# Altium schematic sheet X-Track-ESP32.SchDoc
size A3
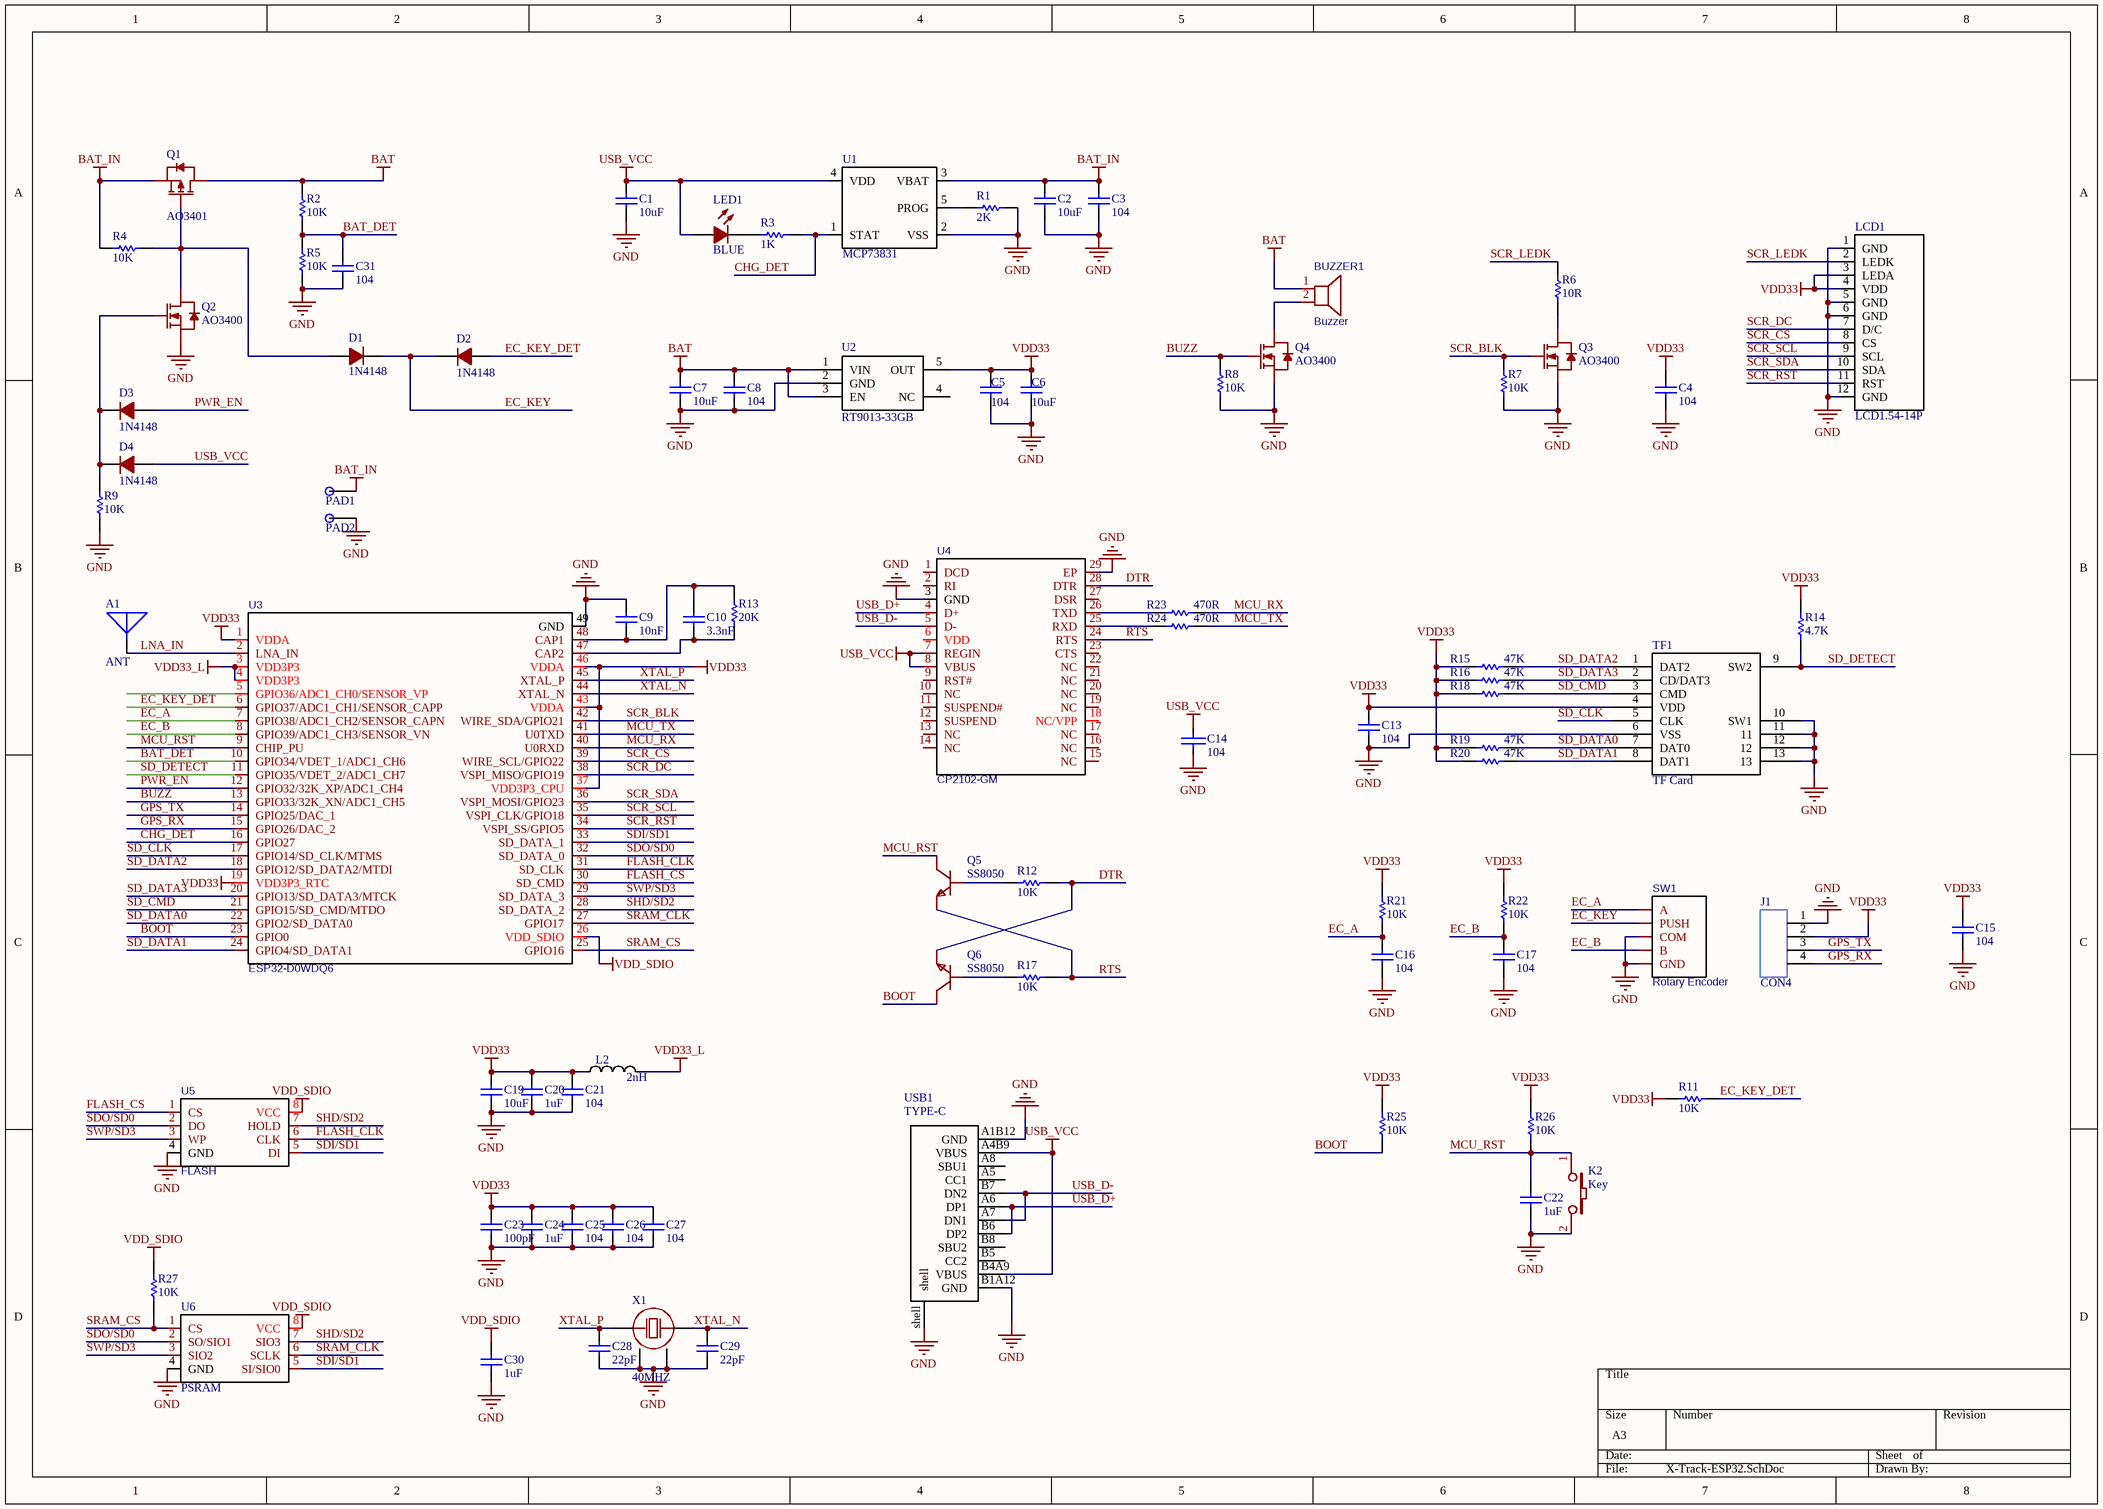
[diagram p0: X-Track-ESP32.SchDoc]

## Parts
A1  ANT  [ANT-Rainsun-AN5120]
BUZZER1  Buzzer  [BUZZ-SMD_5020]
C1  10uF  [C 0402]
C2  10uF  [C 0402]
C3  104  [C 0402]
C4  104  [C 0402]
C5  104  [C 0402]
C6  10uF  [C 0402]
C7  10uF  [C 0402]
C8  104  [C 0402]
C9  10nF  [C 0402]
C10  3.3nF  [C 0402]
C13  104  [C 0402]
C14  104  [C 0402]
C15  104  [C 0402]
C16  104  [C 0402]
C17  104  [C 0402]
C19  10uF  [C 0402]
C20  1uF  [C 0402]
C21  104  [C 0402]
C22  1uF  [C 0402]
C23  100pF  [C 0402]
C24  1uF  [C 0402]
C25  104  [C 0402]
C26  104  [C 0402]
C27  104  [C 0402]
C28  22pF  [C 0402]
C29  22pF  [C 0402]
C30  1uF  [C 0402]
C31  104  [C 0402]
D1  1N4148  [SOD523]
D2  1N4148  [SOD523]
D3  1N4148  [SOD523]
D4  1N4148  [SOD523]
J1  CON4  [GPS-HTZN]
K2  Key  [SW-SMD_3*4]
L2  2nH  [L 0402]
LCD1  LCD1.54-14P  [ZJY154T-PG04 FPC 0.7MM]
LED1  BLUE  [LED 0603]
PAD1  PAD  [PAD]  (value not drawn)
PAD2  PAD  [PAD]  (value not drawn)
Q1  AO3401  [SOT-23]
Q2  AO3400  [SOT-23]
Q3  AO3400  [SOT-23]
Q4  AO3400  [SOT-23]
Q5  SS8050  [SOT-23]
Q6  SS8050  [SOT-23]
R1  2K  [R 0402]
R2  10K  [R 0402]
R3  1K  [R 0402]
R4  10K  [R 0402]
R5  10K  [R 0402]
R6  10R  [R 0402]
R7  10K  [R 0402]
R8  10K  [R 0402]
R9  10K  [R 0402]
R11  10K  [R 0402]
R12  10K  [R 0402]
R13  20K  [R 0402]
R14  4.7K  [R 0402]
R15  47K  [R 0402]
R16  47K  [R 0402]
R17  10K  [R 0402]
R18  47K  [R 0402]
R19  47K  [R 0402]
R20  47K  [R 0402]
R21  10K  [R 0402]
R22  10K  [R 0402]
R23  470R  [R 0402]
R24  470R  [R 0402]
R25  10K  [R 0402]
R26  10K  [R 0402]
R27  10K  [R 0402]
SW1  Rotary Encoder  [SIQ-02FVS3]
TF1  TF Card  [TF-Card]
U1  MCP73831  [SOT23-5]
U2  RT9013-33GB  [SOT23-5]
U3  ESP32-D0WDQ6  [QFN-48]
U4  CP2102-GM  [QFN-28]
U5  FLASH  [SOIC-8]
U6  PSRAM  [SOP-8]
USB1  TYPE-C  [USB-TYPE-C]
X1  40MHZ  [SMD-3225]

## Nets
BAT: BUZZER1.1 C7.2 C8.2 Q1.3(D) R2.2 U2.1(VIN) U2.3(EN)
BAT_IN: C2.2 C3.2 PAD1.1(TP) Q1.2(S) R4.2 U1.3(VBAT)
GND: C1.1 C2.1 C3.1 C4.1 C5.1 C6.1 C7.1 C8.1 C9.2 C13.2 C14.1 C15.1 C16.2 C17.2 C19.1 C20.1 C21.1 C22.2 C23.1 C24.1 C25.1 C26.1 C27.1 C28.1 C29.2 C30.1 C31.1 J1.1 K2.2 LCD1.1(GND) LCD1.5(GND) LCD1.6(GND) LCD1.12(GND) PAD2.1(TP) Q2.2(S) Q3.2(S) Q4.2(S) R1.1 R5.1 R7.2 R8.2 R9.1 SW1.3(COM) SW1.5(GND) TF1.6(VSS) TF1.10(SW1) TF1.11 TF1.12 TF1.13 U1.2(VSS) U2.2(GND) U3.49(GND) U4.3(GND) U4.29(EP) U5.4(GND) U6.4(GND) USB1.A1B12(GND) USB1.B1A12(GND) USB1.shell X1.2 X1.4
USB_VCC: C1.2 C14.2 D4.1(A) LED1.1(A) U1.4(VDD) U4.7(REGIN) U4.8(VBUS) USB1.A4B9(VBUS) USB1.B4A9(VBUS)
VDD33: C4.2 C5.2 C6.2 C13.1 C15.2 C19.2 C20.2 C21.2 C23.2 C24.2 C25.2 C26.2 C27.2 J1.2 L2.1 LCD1.3(LEDA) LCD1.4(VDD) R11.1 R14.2 R15.1 R16.1 R18.1 R19.1 R20.1 R21.1 R22.1 R25.1 R26.1 TF1.4(VDD) U2.5(OUT) U3.1(VDDA) U3.19(VDD3P3_RTC) U3.37(VDD3P3_CPU) U3.43(VDDA) U3.46(VDDA)
VDD33_L: L2.2 U3.3(VDD3P3) U3.4(VDD3P3)
VDD_SDIO: C30.2 R27.1 U3.26(VDD_SDIO) U5.8(VCC) U6.8(VCC)
BAT_DET: C31.2 R2.1 R5.2 U3.10(GPIO34/VDET_1/ADC1_CH6)
BOOT: Q6.3(C) R25.2 U3.23(GPIO0)
BUZZ: Q4.1(G) R8.1 U3.13(GPIO33/32K_XN/ADC1_CH5)
CHG_DET: R3.1 U1.1(STAT) U3.16(GPIO27)
DTR: Q6.2(E) R12.1 U4.28(DTR)
EC_A: C16.1 R21.2 SW1.1(A) U3.7(GPIO38/ADC1_CH2/SENSOR_CAPN)
EC_B: C17.1 R22.2 SW1.4(B) U3.8(GPIO39/ADC1_CH3/SENSOR_VN)
EC_KEY: D1.2(C) D2.2(C) SW1.2(PUSH)
EC_KEY_DET: D2.1(A) R11.2 U3.6(GPIO37/ADC1_CH1/SENSOR_CAPP)
FLASH_CLK: U3.31(SD_CLK) U5.6(CLK)
FLASH_CS: U3.30(SD_CMD) U5.1(CS)
GPS_RX: J1.4 U3.15(GPIO26/DAC_2)
GPS_TX: J1.3 U3.14(GPIO25/DAC_1)
LNA_IN: A1.1 U3.2(LNA_IN)
MCU_RST: C22.1 K2.1 Q5.3(C) R26.2 U3.9(CHIP_PU)
MCU_RX: R23.2 U3.40(U0RXD)
MCU_TX: R24.2 U3.41(U0TXD)
PWR_EN: D3.1(A) U3.12(GPIO32/32K_XP/ADC1_CH4)
RTS: Q5.2(E) R17.1 U4.24(RTS)
SCR_BLK: Q3.1(G) R7.1 U3.42(WIRE_SDA/GPIO21)
SCR_CS: LCD1.8(CS) U3.39(WIRE_SCL/GPIO22)
SCR_DC: LCD1.7(D/C) U3.38(VSPI_MISO/GPIO19)
SCR_LEDK: LCD1.2(LEDK) R6.2
SCR_RST: LCD1.11(RST) U3.34(VSPI_SS/GPIO5)
SCR_SCL: LCD1.9(SCL) U3.35(VSPI_CLK/GPIO18)
SCR_SDA: LCD1.10(SDA) U3.36(VSPI_MOSI/GPIO23)
SD_CLK: TF1.5(CLK) U3.17(GPIO14/SD_CLK/MTMS)
SD_CMD: R18.2 TF1.3(CMD) U3.21(GPIO15/SD_CMD/MTDO)
SD_DATA0: R19.2 TF1.7(DAT0) U3.22(GPIO2/SD_DATA0)
SD_DATA1: R20.2 TF1.8(DAT1) U3.24(GPIO4/SD_DATA1)
SD_DATA2: R15.2 TF1.1(DAT2) U3.18(GPIO12/SD_DATA2/MTDI)
SD_DATA3: R16.2 TF1.2(CD/DAT3) U3.20(GPIO13/SD_DATA3/MTCK)
SD_DETECT: R14.1 TF1.9(SW2) U3.11(GPIO35/VDET_2/ADC1_CH7)
SDI/SD1: U3.33(SD_DATA_1) U5.5(DI) U6.5(SI/SIO0)
SDO/SD0: U3.32(SD_DATA_0) U5.2(DO) U6.2(SO/SIO1)
SHD/SD2: U3.28(SD_DATA_2) U5.7(HOLD) U6.7(SIO3)
SRAM_CLK: U3.27(GPIO17) U6.6(SCLK)
SRAM_CS: R27.2 U3.25(GPIO16) U6.1(CS)
SWP/SD3: U3.29(SD_DATA_3) U5.3(WP) U6.3(SIO2)
USB_D+: U4.4(D+) USB1.A6(DP1) USB1.B6(DP2)
USB_D-: U4.5(D-) USB1.A7(DN1) USB1.B7(DN2)
XTAL_N: C29.1 U3.44(XTAL_N) X1.3
XTAL_P: C28.2 U3.45(XTAL_P) X1.1
NetBUZZER1_2: BUZZER1.2 Q4.3(D)
NetC9_1: C9.1 C10.2 R13.2 U3.48(CAP1)
NetC10_1: C10.1 R13.1 U3.47(CAP2)
NetD1_1: D1.1(A) Q1.1(G) Q2.3(D) R4.1
NetD3_2: D3.2(C) D4.2(C) Q2.1(G) R9.2
NetLED1_2: LED1.2(C) R3.2
NetQ3_3: Q3.3(D) R6.1
NetQ5_1: Q5.1(B) R12.2
NetQ6_1: Q6.1(B) R17.2
NetR1_2: R1.2 U1.5(PROG)
NetR23_1: R23.1 U4.26(TXD)
NetR24_1: R24.1 U4.25(RXD)

Not connected (* = marked no-connect by the designer): U2 4(NC); U3 5(GPIO36/ADC1_CH0/SENSOR_VP); U4 1(DCD) 2(RI) 6(VDD) 9(RST#) 10(NC) 11(SUSPEND#) 12(SUSPEND) 13(NC) 14(NC) 15(NC) 16(NC) 17(NC) 18(NC/VPP) 19(NC) 20(NC) 21(NC) 22(NC) 23(CTS) 27(DSR); USB1 A5(CC1) A8(SBU1) B5(CC2) B8(SBU2)

## Library data of the parts
BUZZER1 = Buzzer: BOM_Manufacturer: S&S; BOM_Manufacturer Part: SFN-1207PA6.5; Contributor: LCSC; BOM_Paste Type: expand; BOM_Assembly Type: manualWeld; BOM_Supplier Part: C360618; spicePre: B; spiceSymbolName: SFN-1207PA6.5
C1-C10 C15 C19-C21 C23-C31 = CAP
C13 C16 C17 C22 = Cap: Capacitor
C14 = CAP: Capacitor
D1-D4 = Diode
L2 = Inductor
LCD1 = LCD1.54-14P_1
LED1 = LED
Q1 = PMOS
Q2-Q4 = NMOS
Q5 Q6 = NPN
R1-R9 R11-R27 = RES
SW1 = Rotary Encoder: BOM_Manufacturer: ALPSALPINE; BOM_Manufacturer Part: EC11E1534443; Contributor: LCSC; BOM_Supplier: LCSC; BOM_Supplier Part: C1322543; BOM_JLCPCB Part Class: Extended Part; spicePre: S; spiceSymbolName: EC11E1534443
U2 = SPX3819
U3 = ESP32-D0WDQ6: BOM_Manufacturer: Espressif Systems; Contributor: LCSC; BOM_Supplier: LCSC; BOM_Supplier Part: C129733; BOM_Manufacturer Part: ESP32-D0WDQ6; BOM_JLCPCB Part Class: Extended Part; spicePre: U; spiceSymbolName: ESP32-D0WDQ6
U4 = CP2102-GM: BOM_Manufacturer: SILICON LABS; Contributor: LCSC; BOM_Supplier: LCSC; BOM_Supplier Part: C430012; BOM_Manufacturer Part: CP2102-GM; BOM_JLCPCB Part Class: Extended Part; spicePre: U; spiceSymbolName: CP2102-GM
U5 = FLASH: BOM_Manufacturer: Winbond Elec; BOM_Manufacturer Part: W25Q32JVSSIQ; Contributor: LCSC; BOM_Supplier: LCSC; BOM_Supplier Part: C179173; BOM_JLCPCB Part Class: Extended Part; spicePre: U; spiceSymbolName: W25Q32JVSSIQ_C179173
USB1 = USB TYPE-C: TYPE-C 16pin
X1 = XTAL-4P